# Altium schematic sheet STM32F103-V1.0.SchDoc
size A2; PageSetup: Record=PageOptions|CenterHorizontal=True|CenterVertical=True|PrintScale=0.71|XCorrection=1.00|YCorrection=1.00|PrintKind=1|BorderSize=5000000|LeftOffset=0|BottomOffset=0|Orientation=2|PaperLength=1000|PaperWidth=1000|Scale=100|PaperSource=7|PrintQuality=-4|MediaType=1|DitherType=10|PaperKind=A3|PrintScaleMode=1
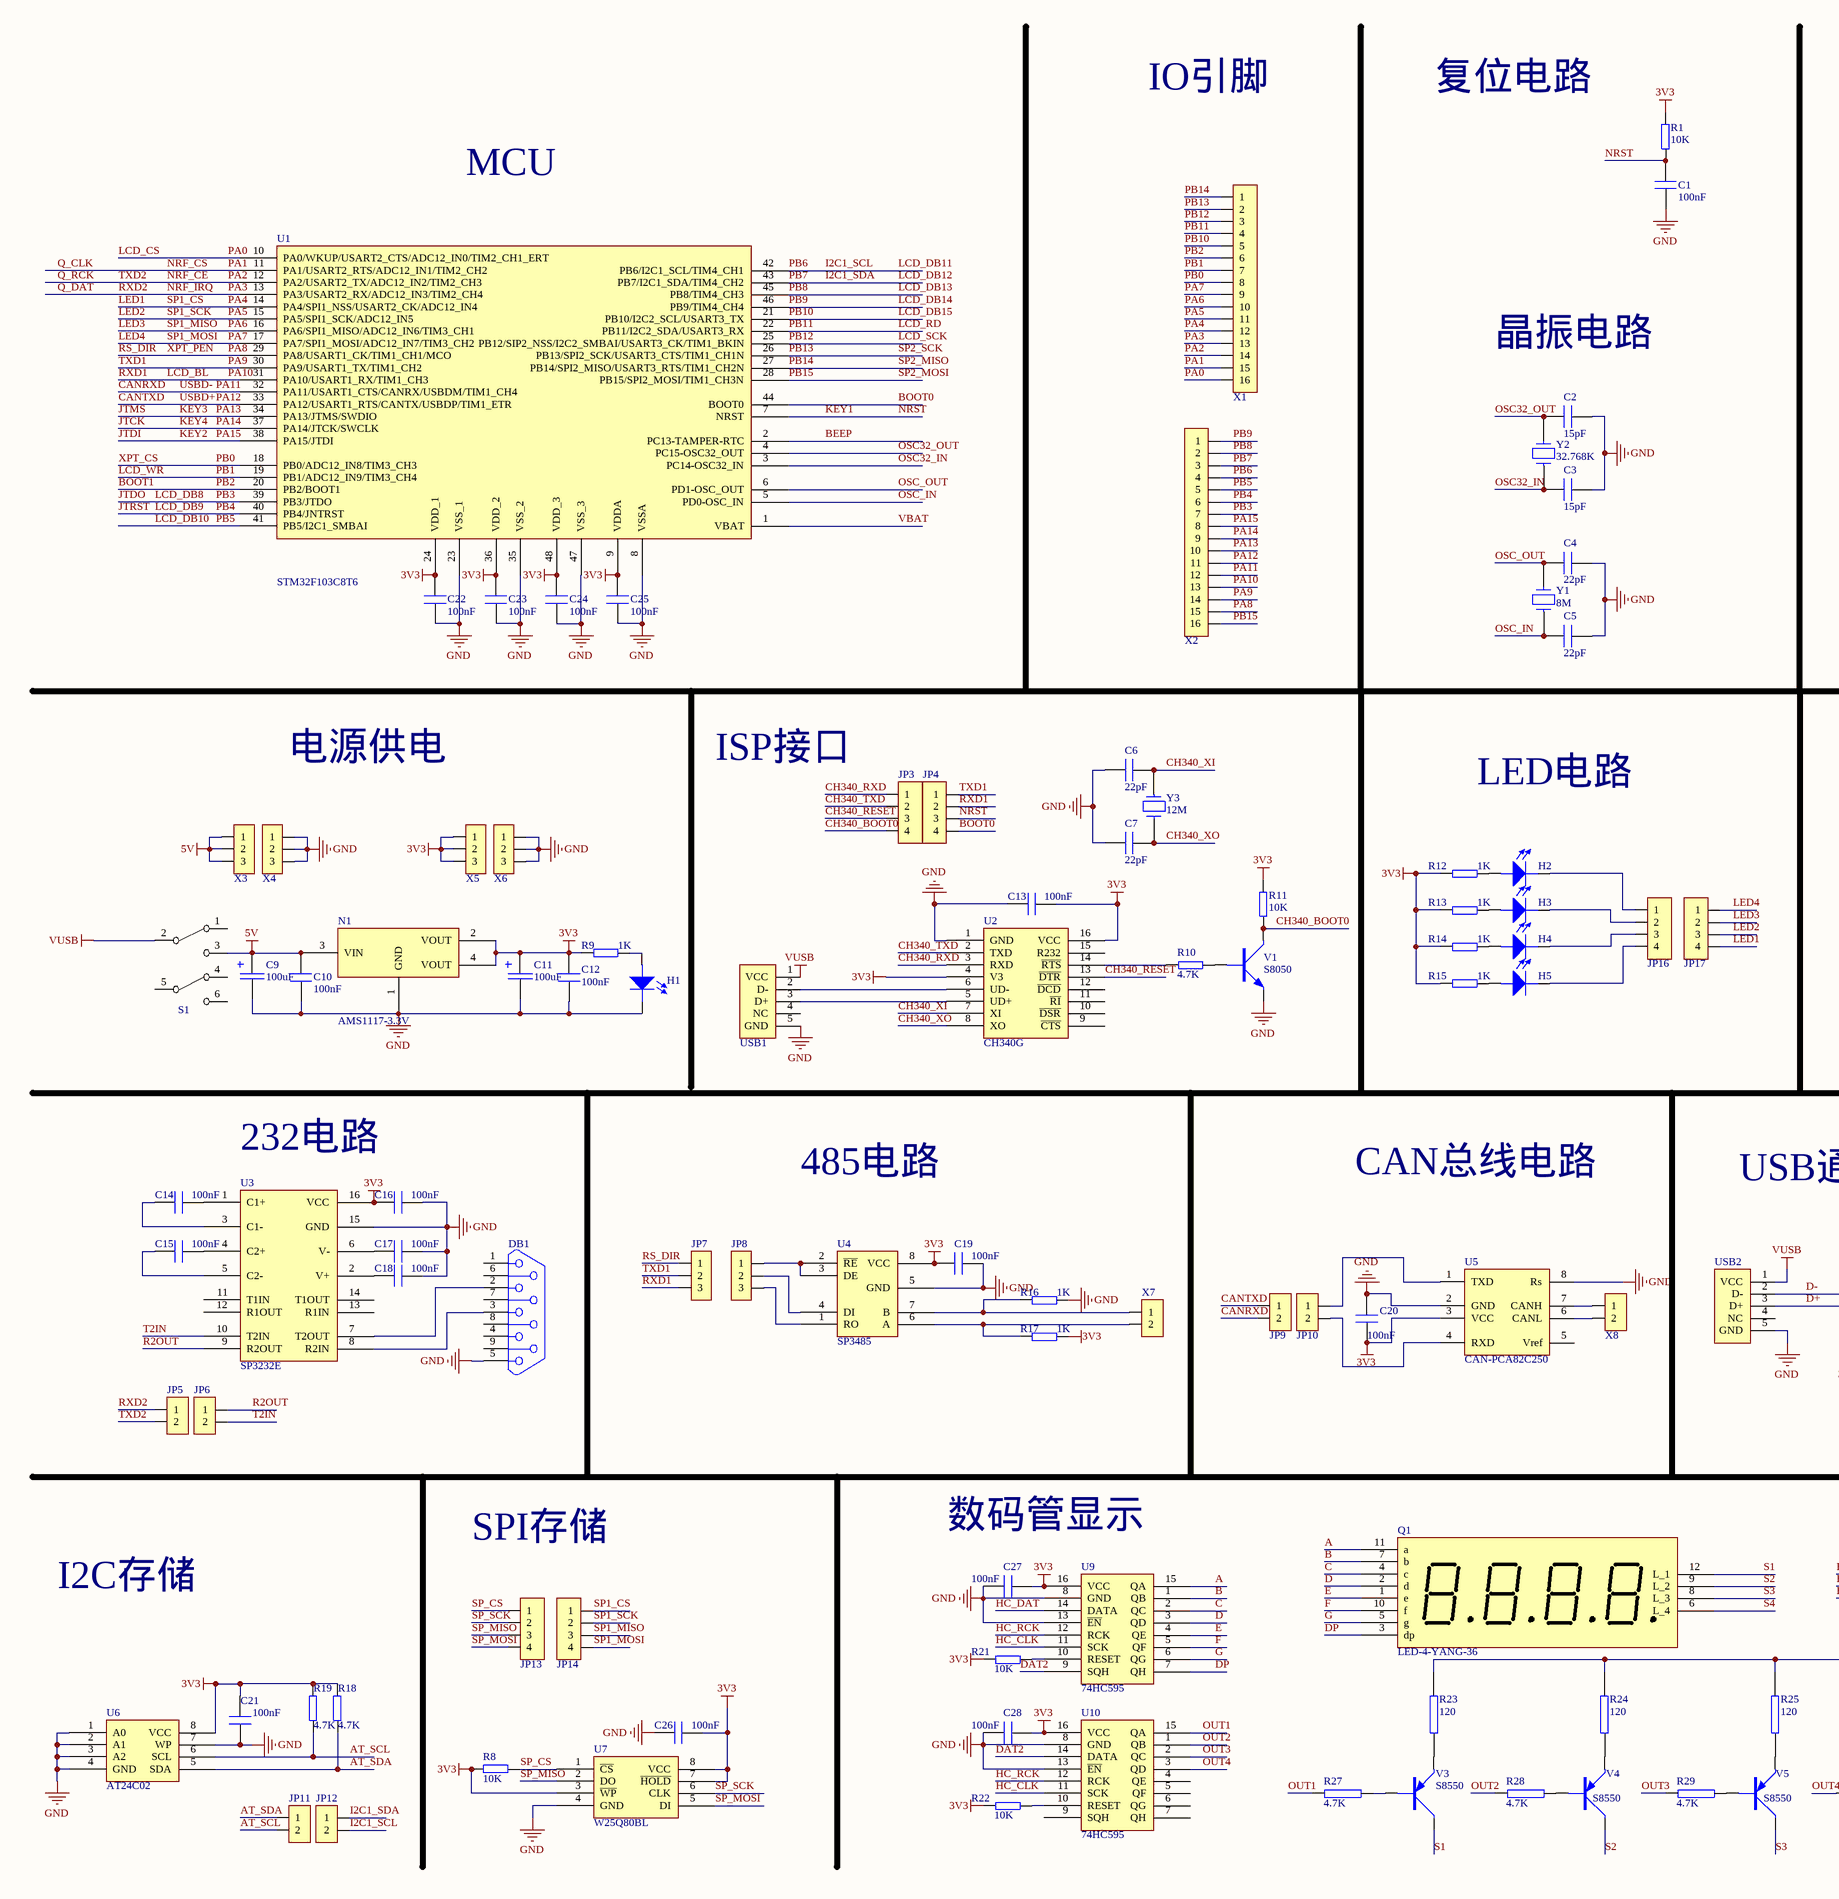
[diagram p0: STM32F103-V1.0.SchDoc, left]
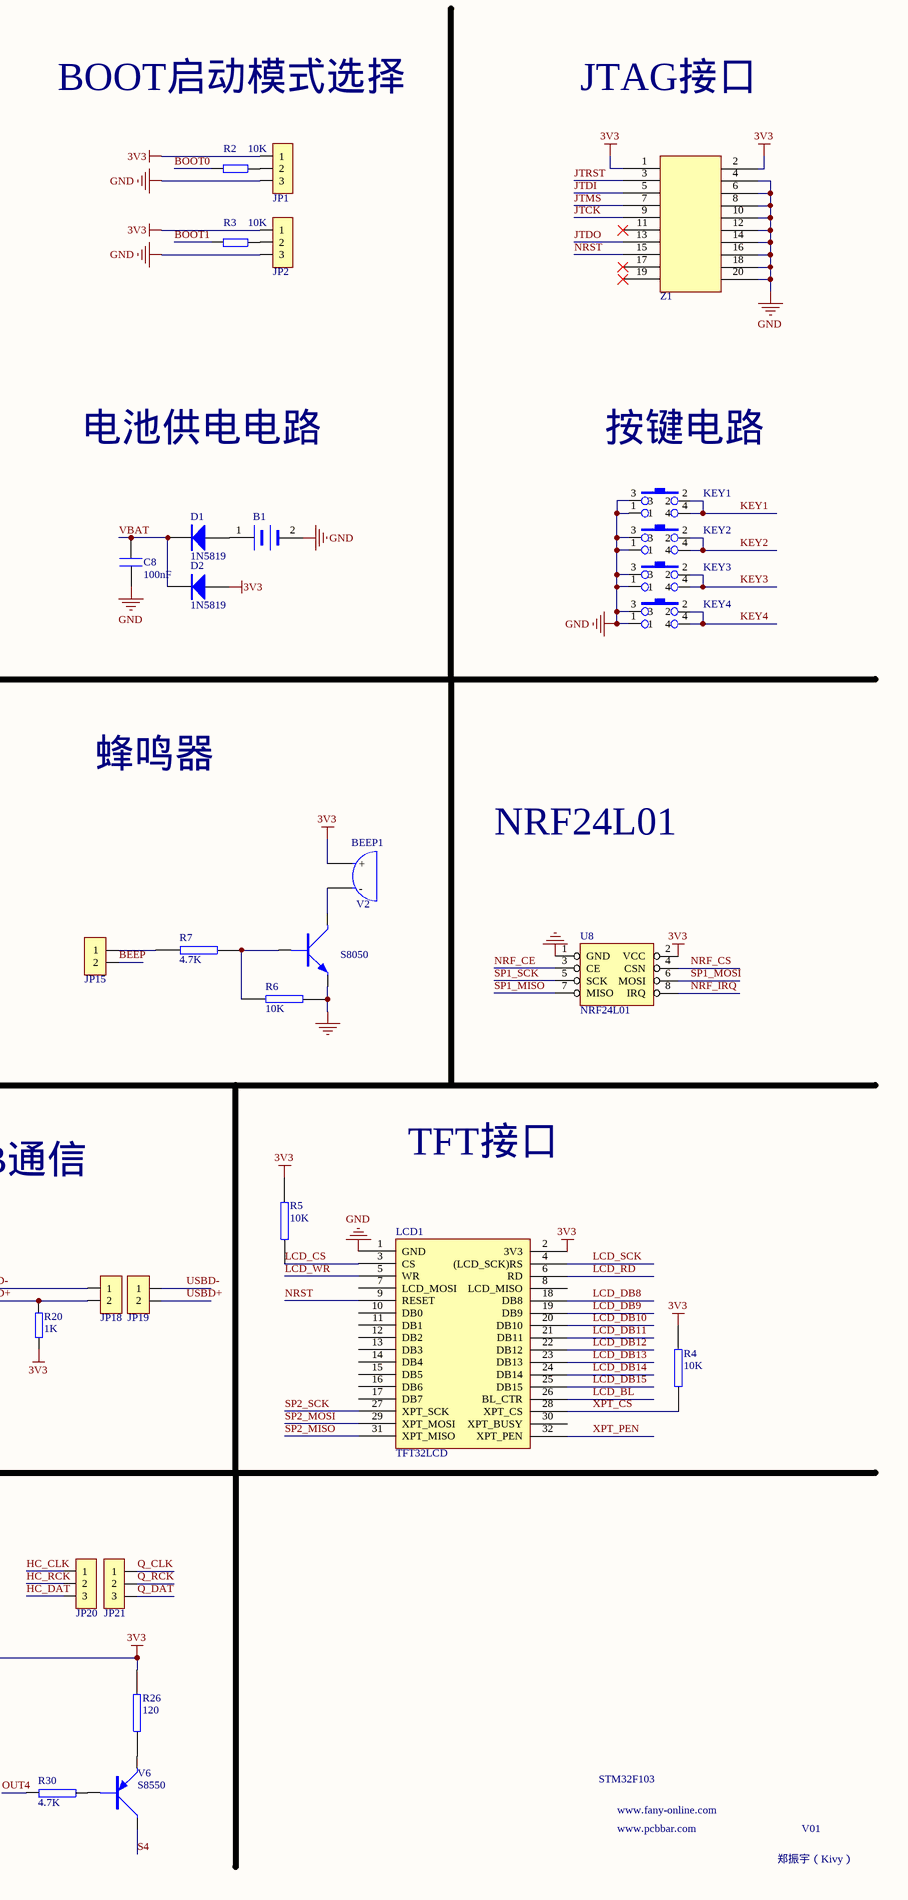
[diagram p1: STM32F103-V1.0.SchDoc, right]

## Parts
B1  BATTERY  [CR1220]  (value not drawn)
BEEP1  BEEP  [SOT12-7.6]  (value not drawn)
C1  100nF  [C0805]
C2  15pF  [C0805]
C3  15pF  [C0805]
C4  22pF  [C0805]
C5  22pF  [C0805]
C6  22pF  [C0805]
C7  22pF  [C0805]
C8  100nF  [C0805]
C9  100uF  [CAP5*5_4]
C10  100nF  [C0805]
C11  100uF  [CAP5*5_4]
C12  100nF  [C0805]
C13  100nF  [C0805]
C14  100nF  [C0805]
C15  100nF  [C0805]
C16  100nF  [C0805]
C17  100nF  [C0805]
C18  100nF  [C0805]
C19  100nF  [C0805]
C20  100nF  [C0805]
C21  100nF  [C0805]
C22  100nF  [C0805]
C23  100nF  [C0805]
C24  100nF  [C0805]
C25  100nF  [C0805]
C26  100nF  [C0805]
C27  100nF  [C0805]
C28  100nF  [C0805]
D1  1N5819  [1N4148-T]
D2  1N5819  [1N4148-T]
DB1  DB9M  [DB9-M]  (value not drawn)
H1  发光二极管  [LED1206]  (value not drawn)
H2  发光二极管  [LED1206]  (value not drawn)
H3  发光二极管  [LED1206]  (value not drawn)
H4  发光二极管  [LED1206]  (value not drawn)
H5  发光二极管  [LED1206]  (value not drawn)
JP1  JX3  [SIP3]  (value not drawn)
JP2  JX3  [SIP3]  (value not drawn)
JP3  JX4  [SIP4]  (value not drawn)
JP4  JX4  [SIP4]  (value not drawn)
JP5  JX2  [SIP2]  (value not drawn)
JP6  JX2  [SIP2]  (value not drawn)
JP7  JX3  [SIP3]  (value not drawn)
JP8  JX3  [SIP3]  (value not drawn)
JP9  JX2  [SIP2]  (value not drawn)
JP10  JX2  [SIP2]  (value not drawn)
JP11  JX2  [SIP2]  (value not drawn)
JP12  JX2  [SIP2]  (value not drawn)
JP13  JX4  [SIP4]  (value not drawn)
JP14  JX4  [SIP4]  (value not drawn)
JP15  JX2  [SIP2]  (value not drawn)
JP16  JX4  [SIP4]  (value not drawn)
JP17  JX4  [SIP4]  (value not drawn)
JP18  JX2  [SIP2]  (value not drawn)
JP19  JX2  [SIP2]  (value not drawn)
JP20  JX3  [SIP3]  (value not drawn)
JP21  JX3  [SIP3]  (value not drawn)
KEY1  SW-66B7  [SW-66]  (value not drawn)
KEY2  SW-66B7  [SW-66]  (value not drawn)
KEY3  SW-66B7  [SW-66]  (value not drawn)
KEY4  SW-66B7  [SW-66]  (value not drawn)
LCD1  TFT32LCD  [HEAD16×2]
N1  AMS1117-3.3V  [SOT223]
Q1  LED-4-YANG-36  [LED0.36-4]
R1  10K  [R0805]
R2  10K  [R0805]
R3  10K  [R0805]
R4  10K  [R0805]
R5  10K  [R0805]
R6  10K  [R0805]
R7  4.7K  [R0805]
R8  10K  [R0805]
R9  1K  [R0805]
R10  4.7K  [R0805]
R11  10K  [R0805]
R12  1K  [R0805]
R13  1K  [R0805]
R14  1K  [R0805]
R15  1K  [R0805]
R16  1K  [R0805]
R17  1K  [R0805]
R18  4.7K  [R0805]
R19  4.7K  [R0805]
R20  1K  [R0805]
R21  10K  [R0805]
R22  10K  [R0805]
R23  120  [R0805]
R24  120  [R0805]
R25  120  [R0805]
R26  120  [R0805]
R27  4.7K  [R0805]
R28  4.7K  [R0805]
R29  4.7K  [R0805]
R30  4.7K  [R0805]
S1  SWITCH-6  [SW-AJ]  (value not drawn)
U1  STM32F103C8T6  [LQFP48]
U2  CH340G  [SOIC16]
U3  SP3232E  [SOIC16]
U4  SP3485  [SO-8]
U5  CAN-PCA82C250  [SO-8]
U6  AT24C02  [SO-8]
U7  W25Q80BL  [W25Q-SO8]
U8  NRF24L01  [NRF24L01]
U9  74HC595  [SO-16]
U10  74HC595  [SO-16]
USB1  MicroUSB  [MicroUSB1]  (value not drawn)
USB2  MicroUSB  [MicroUSB1]  (value not drawn)
V1  S8050  [SOT23-C1]
V2  S8050  [SOT23-C1]
V3  S8550  [SOT23-C1]
V4  S8550  [SOT23-C1]
V5  S8550  [SOT23-C1]
V6  S8550  [SOT23-C1]
X1  JX16  [SIP16]  (value not drawn)
X2  JX16  [SIP16]  (value not drawn)
X3  JX3  [SIP3]  (value not drawn)
X4  JX3  [SIP3]  (value not drawn)
X5  JX3  [SIP3]  (value not drawn)
X6  JX3  [SIP3]  (value not drawn)
X7  JX2  [WJ128-5.0-2P]  (value not drawn)
X8  JX2  [WJ128-5.0-2P]  (value not drawn)
Y1  8M  [JZ-AX]
Y2  32.768K  [FC135]
Y3  12M  [JZ-AX]
Z1  HEADER 10X2  [JTAG]  (value not drawn)

## Nets
3V3: BEEP1.1(+) C11.1 C12.1 C13.2 C16.1 C19.1 C20.2 C21.2 C22.1 C23.1 C24.1 C25.1 C26.2 C27.1 C28.1 D2.1(A) JP1.1 JP2.1 LCD1.2(3V3) N1.2(VOUT) N1.4(VOUT) R1.2 R4.1 R5.2 R8.2 R9.1 R11.2 R12.1 R13.1 R14.1 R15.1 R17.2 R18.2 R19.2 R20.2 R21.1 R22.1 R23.2 R24.2 R25.2 R26.2 U1.9(VDDA) U1.24(VDD_1) U1.36(VDD_2) U1.48(VDD_3) U2.4(V3) U2.16(VCC) U3.16(VCC) U4.8(VCC) U5.3(VCC) U6.8(VCC) U7.3(~{WP}) U7.7(~{HOLD}) U7.8(VCC) U8.2(VCC) U9.16(VCC) U10.16(VCC) X5.1 X5.2 X5.3 Z1.1 Z1.2
5V: C9.1 C10.1 N1.3(VIN) S1.3 X3.1 X3.2 X3.3
GND: B1.2(-) C1.1 C2.2 C3.2 C4.2 C5.2 C6.1 C7.1 C8.1 C9.2 C10.2 C11.2 C12.2 C13.1 C16.2 C17.2 C18.2 C19.2 C20.1 C21.1 C22.2 C23.2 C24.2 C25.2 C26.1 C27.2 C28.2 DB1.5 H1.2(K) JP1.3 JP2.3 KEY1.1 KEY1.3 KEY2.1 KEY2.3 KEY3.1 KEY3.3 KEY4.1 KEY4.3 LCD1.1(GND) N1.1(GND) R6.1 R16.2 U1.8(VSSA) U1.23(VSS_1) U1.35(VSS_2) U1.47(VSS_3) U2.1(GND) U3.15(GND) U4.5(GND) U5.2(GND) U5.8(Rs) U6.1(A0) U6.2(A1) U6.3(A2) U6.4(GND) U6.7(WP) U7.4(GND) U8.1(GND) U9.8(GND) U9.13(~{EN}) U10.8(GND) U10.13(~{EN}) USB1.5(GND) USB2.5(GND) V1.E V2.E X4.1 X4.2 X4.3 X6.1 X6.2 X6.3 Z1.4 Z1.6 Z1.8 Z1.10 Z1.12 Z1.14 Z1.16 Z1.18 Z1.20
VUSB: S1.2 USB1.1(VCC) USB2.1(VCC)
A: Q1.11(a) U9.15(QA)
AT_SCL: JP11.2 R19.1 U6.6(SCL)
AT_SDA: JP11.1 R18.1 U6.5(SDA)
B: Q1.7(b) U9.1(QB)
BEEP: JP15.2 U1.2(PC13-TAMPER-RTC)
BOOT0: JP4.4 R2.1 U1.44(BOOT0)
BOOT1: R3.1 U1.20(PB2/BOOT1) X1.6  [also labelled PB2]
C: Q1.4(c) U9.2(QC)
CANRXD: JP9.2 JP19.1 U1.32(PA11/USART1_CTS/CANRX/USBDM/TIM1_CH4) X2.12  [also labelled PA11, USBD-]
CANTXD: JP9.1 JP19.2 U1.33(PA12/USART1_RTS/CANTX/USBDP/TIM1_ETR) X2.11  [also labelled PA12, USBD+]
CH340_BOOT0: JP3.4 R11.1 V1.C
CH340_RESET: JP3.3 U2.13(~{DTR})
CH340_RXD: JP3.1 U2.3(RXD)
CH340_TXD: JP3.2 U2.2(TXD)
CH340_XI: C6.2 U2.7(XI) Y3.1
CH340_XO: C7.2 U2.8(XO) Y3.2
D: Q1.2(d) U9.3(QD)
D+: JP18.2 R20.1 USB2.3(D+)
D-: JP18.1 USB2.2(D-)
DAT2: U9.9(SQH) U10.14(DATA)
DP: Q1.3(dp) U9.7(QH)
E: Q1.1(e) U9.4(QE)
F: Q1.10(f) U9.5(QF)
G: Q1.5(g) U9.6(QG)
HC_CLK: JP20.1 U9.11(SCK) U10.11(SCK)
HC_DAT: JP20.3 U9.14(DATA)
HC_RCK: JP20.2 U9.12(RCK) U10.12(RCK)
I2C1_SCL: JP12.2 LCD1.21(DB11) U1.42(PB6/I2C1_SCL/TIM4_CH1) X2.4  [also labelled LCD_DB11, PB6]
I2C1_SDA: JP12.1 LCD1.22(DB12) U1.43(PB7/I2C1_SDA/TIM4_CH2) X2.3  [also labelled LCD_DB12, PB7]
JTCK: KEY4.2 KEY4.4 U1.37(PA14/JTCK/SWCLK) X2.9 Z1.9  [also labelled KEY4, PA14]
JTDI: KEY2.2 KEY2.4 U1.38(PA15/JTDI) X2.8 Z1.5  [also labelled KEY2, PA15]
JTDO: LCD1.18(DB8) U1.39(PB3/JTDO) X2.7 Z1.13  [also labelled LCD_DB8, PB3]
JTMS: KEY3.2 KEY3.4 U1.34(PA13/JTMS/SWDIO) X2.10 Z1.7  [also labelled KEY3, PA13]
JTRST: LCD1.19(DB9) U1.40(PB4/JNTRST) X2.6 Z1.3  [also labelled LCD_DB9, PB4]
KEY1: C1.2 JP4.3 KEY1.2 KEY1.4 LCD1.9(RESET) R1.1 U1.7(NRST) Z1.15  [also labelled NRST]
LCD_BL: JP4.2 JP7.3 LCD1.26(BL_CTR) U1.31(PA10/USART1_RX/TIM1_CH3) X2.13  [also labelled PA10, RXD1]
LCD_CS: LCD1.3(CS) R5.1 U1.10(PA0/WKUP/USART2_CTS/ADC12_IN0/TIM2_CH1_ERT) X1.16  [also labelled PA0]
LCD_DB10: LCD1.20(DB10) U1.41(PB5/I2C1_SMBAI) X2.5  [also labelled PB5]
LCD_DB13: LCD1.23(DB13) U1.45(PB8/TIM4_CH3) X2.2  [also labelled PB8]
LCD_DB14: LCD1.24(DB14) U1.46(PB9/TIM4_CH4) X2.1  [also labelled PB9]
LCD_DB15: LCD1.25(DB15) U1.21(PB10/I2C2_SCL/USART3_TX) X1.5  [also labelled PB10]
LCD_RD: LCD1.6(RD) U1.22(PB11/I2C2_SDA/USART3_RX) X1.4  [also labelled PB11]
LCD_SCK: LCD1.4((LCD_SCK)RS) U1.25(PB12/SIP2_NSS/I2C2_SMBAI/USART3_CK/TIM1_BKIN) X1.3  [also labelled PB12]
LCD_WR: LCD1.5(WR) U1.19(PB1/ADC12_IN9/TIM3_CH4) X1.7  [also labelled PB1]
LED1: JP14.1 JP17.4 U1.14(PA4/SPI1_NSS/USART2_CK/ADC12_IN4) X1.12  [also labelled PA4, SP1_CS]
LED2: JP14.2 JP17.3 U1.15(PA5/SPI1_SCK/ADC12_IN5) U8.5(SCK) X1.11  [also labelled PA5, SP1_SCK]
LED3: JP14.3 JP17.2 U1.16(PA6/SPI1_MISO/ADC12_IN6/TIM3_CH1) U8.7(MISO) X1.10  [also labelled PA6, SP1_MISO]
LED4: JP14.4 JP17.1 U1.17(PA7/SPI1_MOSI/ADC12_IN7/TIM3_CH2) U8.6(MOSI) X1.9  [also labelled PA7, SP1_MOSI]
NRF_CE: JP5.2 JP21.2 U1.12(PA2/USART2_TX/ADC12_IN2/TIM2_CH3) U8.3(CE) X1.14  [also labelled PA2, Q_RCK, TXD2]
NRF_CS: JP21.1 U1.11(PA1/USART2_RTS/ADC12_IN1/TIM2_CH2) U8.4(CSN) X1.15  [also labelled PA1, Q_CLK]
NRF_IRQ: JP5.1 JP21.3 U1.13(PA3/USART2_RX/ADC12_IN3/TIM2_CH4) U8.8(IRQ) X1.13  [also labelled PA3, Q_DAT, RXD2]
OSC32_IN: C3.1 U1.3(PC14-OSC32_IN) Y2.1
OSC32_OUT: C2.1 U1.4(PC15-OSC32_OUT) Y2.2
OSC_IN: C5.1 U1.5(PD0-OSC_IN) Y1.1
OSC_OUT: C4.1 U1.6(PD1-OSC_OUT) Y1.2
OUT1: R27.1 U10.15(QA)
OUT2: R28.1 U10.1(QB)
OUT3: R29.1 U10.2(QC)
OUT4: R30.1 U10.3(QD)
PA8: JP7.1 LCD1.32(XPT_PEN) U1.29(PA8/USART1_CK/TIM1_CH1/MCO) X2.15  [also labelled RS_DIR, XPT_PEN]
PA9: JP4.1 JP7.2 U1.30(PA9/USART1_TX/TIM1_CH2) X2.14  [also labelled TXD1]
PB0: LCD1.28(XPT_CS) R4.2 U1.18(PB0/ADC12_IN8/TIM3_CH3) X1.8  [also labelled XPT_CS]
PB13: LCD1.27(XPT_SCK) U1.26(PB13/SPI2_SCK/USART3_CTS/TIM1_CH1N) X1.2  [also labelled SP2_SCK]
PB14: LCD1.31(XPT_MISO) U1.27(PB14/SPI2_MISO/USART3_RTS/TIM1_CH2N) X1.1  [also labelled SP2_MISO]
PB15: LCD1.29(XPT_MOSI) U1.28(PB15/SPI2_MOSI/TIM1_CH3N) X2.16  [also labelled SP2_MOSI]
R2OUT: JP6.1 U3.9(R2OUT)
S1: Q1.12(L_1) V3.C
S2: Q1.9(L_2) V4.C
S3: Q1.8(L_3) V5.C
S4: Q1.6(L_4) V6.C
SP_CS: JP13.1 R8.1 U7.1(~{CS})
SP_MISO: JP13.3 U7.2(DO)
SP_MOSI: JP13.4 U7.5(DI)
SP_SCK: JP13.2 U7.6(CLK)
T2IN: JP6.2 U3.10(T2IN)
VBAT: C8.2 D1.2(K) D2.2(K) U1.1(VBAT)
NetB1_1: B1.1(+) D1.1(A)
NetBEEP1_2: BEEP1.2(-) V2.C
NetC14_1: C14.1 U3.3(C1-)
NetC14_2: C14.2 U3.1(C1+)
NetC15_1: C15.1 U3.5(C2-)
NetC15_2: C15.2 U3.4(C2+)
NetC17_1: C17.1 U3.6(V-)
NetC18_1: C18.1 U3.2(V+)
NetDB1_2: DB1.2 U3.7(T2OUT)
NetDB1_3: DB1.3 U3.8(R2IN)
NetH1_1: H1.1(A) R9.2
NetH2_1: H2.1(A) R12.2
NetH2_2: H2.2(K) JP16.1
NetH3_1: H3.1(A) R13.2
NetH3_2: H3.2(K) JP16.2
NetH4_1: H4.1(A) R14.2
NetH4_2: H4.2(K) JP16.3
NetH5_1: H5.1(A) R15.2
NetH5_2: H5.2(K) JP16.4
NetJP1_2: JP1.2 R2.2
NetJP2_2: JP2.2 R3.2
NetJP8_1: JP8.1 U4.2(~{RE}) U4.3(DE)
NetJP8_2: JP8.2 U4.4(DI)
NetJP8_3: JP8.3 U4.1(RO)
NetJP10_1: JP10.1 U5.1(TXD)
NetJP10_2: JP10.2 U5.4(RXD)
NetJP15_1: JP15.1 R7.1
NetR6_2: R6.2 R7.2 V2.B
NetR10_1: R10.1 U2.14(~{RTS})
NetR10_2: R10.2 V1.B
NetR16_1: R16.1 U4.7(B) X7.1
NetR17_1: R17.1 U4.6(A) X7.2
NetR21_2: R21.2 U9.10(RESET)
NetR22_2: R22.2 U10.10(RESET)
NetR23_1: R23.1 V3.E
NetR24_1: R24.1 V4.E
NetR25_1: R25.1 V5.E
NetR26_1: R26.1 V6.E
NetR27_2: R27.2 V3.B
NetR28_2: R28.2 V4.B
NetR29_2: R29.2 V5.B
NetR30_2: R30.2 V6.B
NetU2_5: U2.5(UD+) USB1.3(D+)
NetU2_6: U2.6(UD-) USB1.2(D-)
NetU5_6: U5.6(CANL) X8.2
NetU5_7: U5.7(CANH) X8.1

Not connected (* = marked no-connect by the designer): DB1 1 4 6 7 8 9; LCD1 7(LCD_MOSI) 8(LCD_MISO) 10(DB0) 11(DB1) 12(DB2) 13(DB3) 14(DB4) 15(DB5) 16(DB6) 17(DB7) 30(XPT_BUSY); S1 1 4 5 6; U2 9(~{CTS}) 10(~{DSR}) 11(~{RI}) 12(~{DCD}) 15(R232); U3 11(T1IN) 12(R1OUT) 13(R1IN) 14(T1OUT); U5 5(Vref); U10 4(QE) 5(QF) 6(QG) 7(QH) 9(SQH); USB1 4(NC); USB2 4(NC); Z1 11* 17* 19*

## Notes on the sheet
- IO引脚
- 复位电路
- BOOT启动模式选择
- JTAG接口
- MCU
- 晶振电路
- 电池供电电路
- 按键电路
- 电源供电
- ISP接口
- LED电路
- 蜂鸣器
- NRF24L01
- (near U3) 232电路
- 485电路
- CAN总线电路
- USB通信
- TFT接口
- SPI存储
- 数码管显示
- I2C存储
- STM32F103
- www.fany-online.com
- www.pcbbar.com
- 郑振宇（Kivy）
- V01

## Library data of the parts
C1-C8 C10 C12-C28 = 普通贴片电容: Capacitor
C9 C11 = 极性电容器: TD_Model: *
D1 D2 = 贴片二极管: Diode 1N series
DB1 = DB9M: 母头
JP1 JP2 JP7 JP8 JP20 JP21 X3-X6 = JX3: Connector
JP3 JP4 JP13 JP14 JP16 JP17 = JX4: Connector
JP5 JP6 JP9-JP12 JP15 JP18 JP19 X7 X8 = JX2: Connector
R1-R3 R8-R22 = 普通贴片电阻
R4-R7 R23-R26 = RES
R27-R30 = RES2
U3 = SP3232E: SP3232EEN-L/TR;SOIC-39MM
U4 = MAX3082
U9 U10 = 74HC595: 串入并出移位寄存器
USB1 USB2 = MicroUSB: 母头
V1 V2 = NPN三极管: V
V3-V6 = PNP三极管: V
Y1-Y3 = CRYSTAL